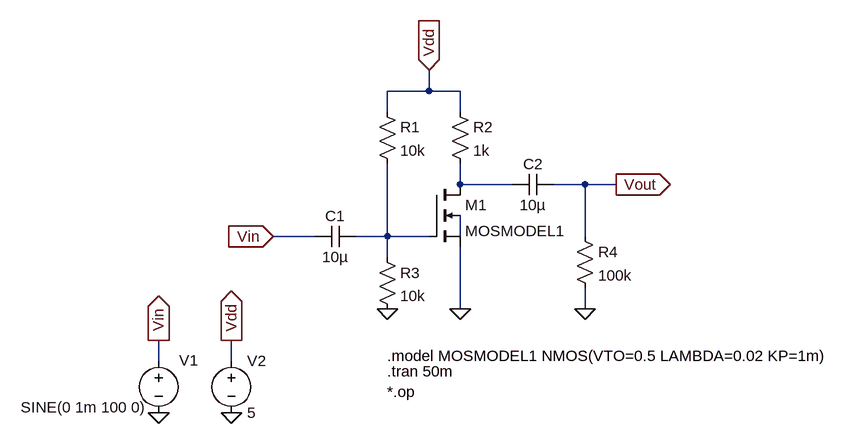
[diagram p0: schematic CS stage.asc]
CS stage.asc, the LTspice schematic file:
Version 4
SHEET 1 880 680
WIRE 240 -128 240 -160
WIRE 240 -128 176 -128
WIRE 288 -128 240 -128
WIRE 176 -96 176 -128
WIRE 288 -96 288 -128
WIRE 288 16 288 -16
WIRE 368 16 288 16
WIRE 480 16 432 16
WIRE 528 16 480 16
WIRE 64 96 0 96
WIRE 176 96 176 -16
WIRE 176 96 128 96
WIRE 240 96 176 96
WIRE 288 96 288 64
WIRE 480 96 480 16
WIRE 176 128 176 96
WIRE 288 208 288 112
WIRE 480 208 480 176
WIRE -176 288 -176 256
WIRE -64 288 -64 256
FLAG -176 368 0
FLAG -64 368 0
FLAG 480 208 0
FLAG 176 208 0
FLAG 0 96 Vin
IOPIN 0 96 In
FLAG -176 256 Vin
IOPIN -176 256 Out
FLAG -64 256 Vdd
IOPIN -64 256 Out
FLAG 240 -160 Vdd
IOPIN 240 -160 In
FLAG 528 16 Vout
IOPIN 528 16 Out
FLAG 288 208 0
SYMBOL Res 160 112 R0
SYMATTR InstName R3
SYMATTR Value 10k
SYMBOL Cap 128 80 R90
WINDOW 0 0 32 VBottom 2
WINDOW 3 32 32 VTop 2
SYMATTR InstName C1
SYMATTR Value 10µ
SYMBOL Voltage -176 272 R0
WINDOW 0 61 15 Right 2
WINDOW 3 -212 87 Left 2
WINDOW 39 0 0 Left 0
SYMATTR InstName V1
SYMATTR Value SINE(0 1m 100 0)
SYMBOL nmos4 240 16 R0
SYMATTR InstName M1
SYMATTR Value MOSMODEL1
SYMBOL Voltage -64 272 R0
SYMATTR InstName V2
SYMATTR Value 5
SYMATTR SpiceLine Rser=0
SYMBOL Res 464 80 R0
SYMATTR InstName R4
SYMATTR Value 100k
SYMBOL Cap 432 0 R90
WINDOW 0 0 32 VBottom 2
WINDOW 3 32 32 VTop 2
SYMATTR InstName C2
SYMATTR Value 10µ
SYMBOL Res 160 -112 R0
SYMATTR InstName R1
SYMATTR Value 10k
SYMBOL Res 272 -112 R0
SYMATTR InstName R2
SYMATTR Value 1k
TEXT 176 280 Left 2 !.model MOSMODEL1 NMOS(VTO=0.5 LAMBDA=0.02 KP=1m)
TEXT 176 304 Left 2 !.tran 50m\n*.op

The netlist it stands for:
* CS stage.asc
R3 N002 0 10k
C1 N002 Vin 10µ
V1 Vin 0 SINE(0 1m 100 0)
M1 N001 N002 0 N003 MOSMODEL1
V2 Vdd 0 5 Rser=0
R4 Vout 0 100k
C2 Vout N001 10µ
R1 Vdd N002 10k
R2 Vdd N001 1k
.model NMOS NMOS
.model PMOS PMOS
.lib standard.mos
.model MOSMODEL1 NMOS(VTO=0.5 LAMBDA=0.02 KP=1m)
.tran 50m
*.op
.backanno
.end